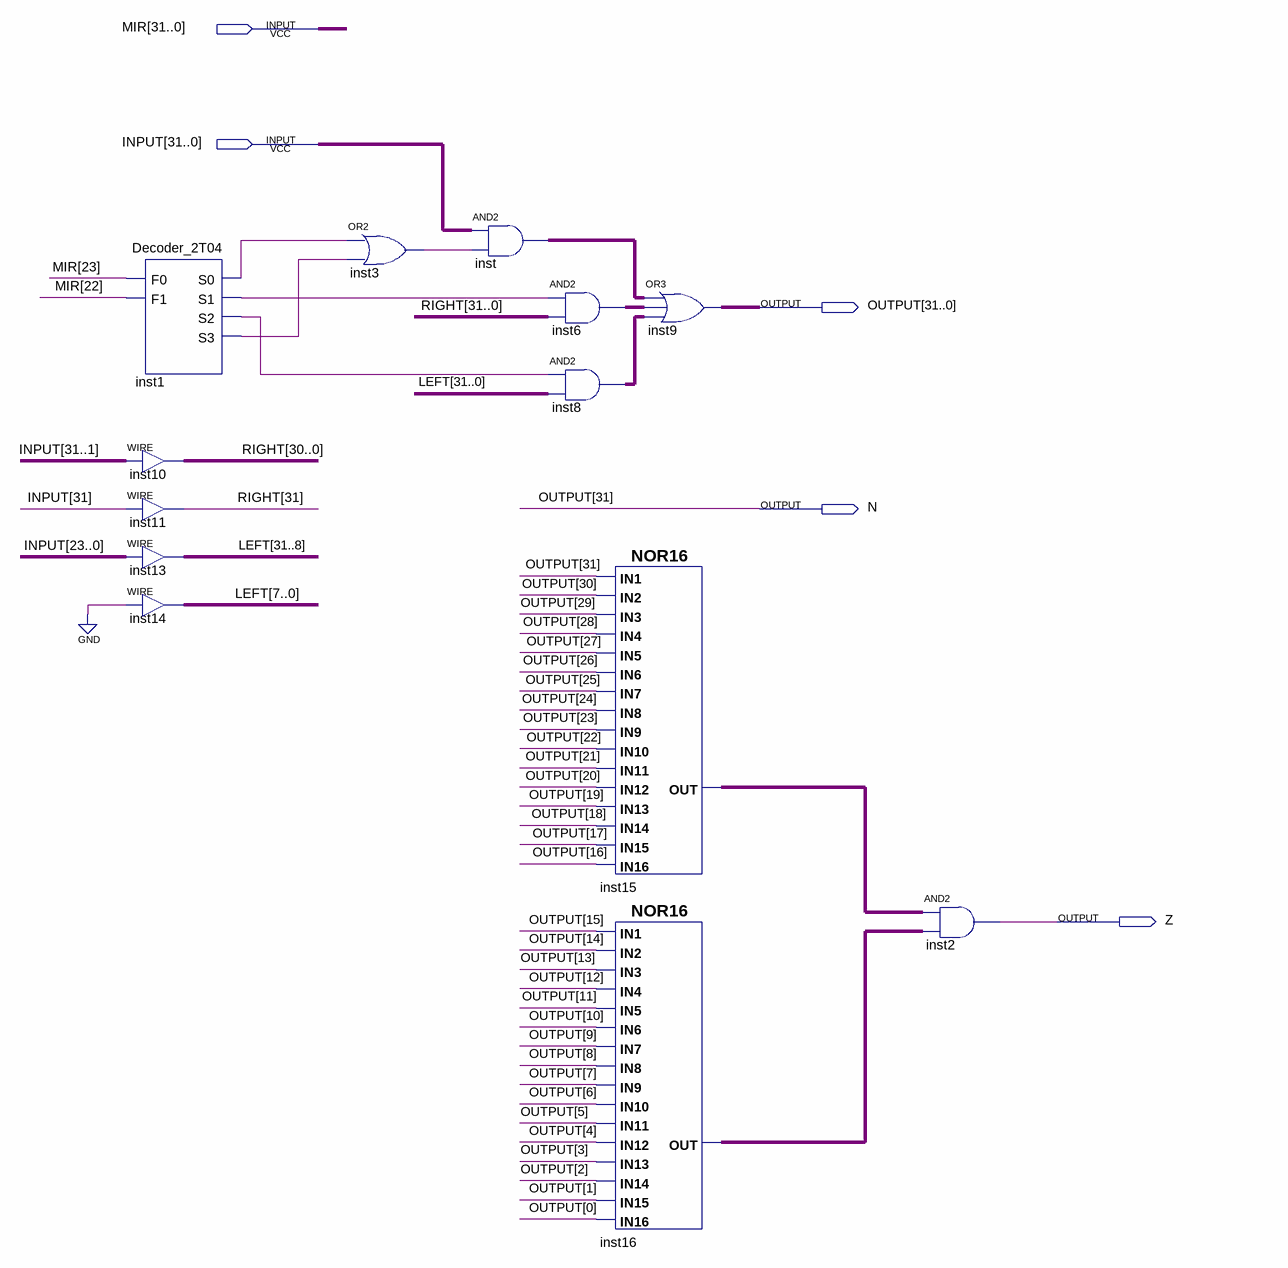
[diagram p0: schematic sheet]
// Quartus schematic SHIFTER.bdf as structural Verilog: 13 symbols, 5 pins
module SHIFTER (
  input  [31:0] MIR,
  input  [31:0] INPUT,
  output [31:0] OUTPUT,
  output N,
  output Z
);

  wire inst1_s0, inst1_s1, inst1_s2, inst1_s3, inst3_out, inst15_out, inst16_out;
  wire [31:0] inst6_out, inst8_out, inst_out, LEFT, RIGHT;

  Decoder_2T04 inst1 (.F0(MIR[23]), .F1(MIR[22]), .S3(inst1_s3), .S2(inst1_s2), .S1(inst1_s1), .S0(inst1_s0));
  assign RIGHT[30:0] = INPUT[31:1];  // WIRE inst10
  assign RIGHT[31] = INPUT[31];  // WIRE inst11
  assign LEFT[31:8] = INPUT[23:0];  // WIRE inst13
  assign LEFT[7:0] = {8{1'b0}};  // WIRE inst14
  or inst3 (inst3_out, inst1_s0, inst1_s3);
  assign inst_out = INPUT & {32{inst3_out}};  // AND2 inst, 32 bits wide
  assign inst6_out = {32{inst1_s1}} & RIGHT;  // AND2 inst6, 32 bits wide
  assign inst8_out = {32{inst1_s2}} & LEFT;  // AND2 inst8, 32 bits wide
  nor inst15 (inst15_out, N, OUTPUT[30], OUTPUT[29], OUTPUT[28], OUTPUT[27], OUTPUT[26], OUTPUT[25], OUTPUT[24], OUTPUT[23], OUTPUT[22], OUTPUT[21], OUTPUT[20], OUTPUT[19], OUTPUT[18], OUTPUT[17], OUTPUT[16]);
  nor inst16 (inst16_out, OUTPUT[15], OUTPUT[14], OUTPUT[13], OUTPUT[12], OUTPUT[11], OUTPUT[10], OUTPUT[9], OUTPUT[8], OUTPUT[7], OUTPUT[6], OUTPUT[5], OUTPUT[4], OUTPUT[3], OUTPUT[2], OUTPUT[1], OUTPUT[0]);
  assign {N, OUTPUT[30:0]} = inst_out | inst6_out | inst8_out;  // OR3 inst9, 32 bits wide
  and inst2 (Z, inst15_out, inst16_out);

  assign OUTPUT[31] = N;
endmodule
